# EAGLE design Fubarino_SD_v14t (EAGLE 6.3)
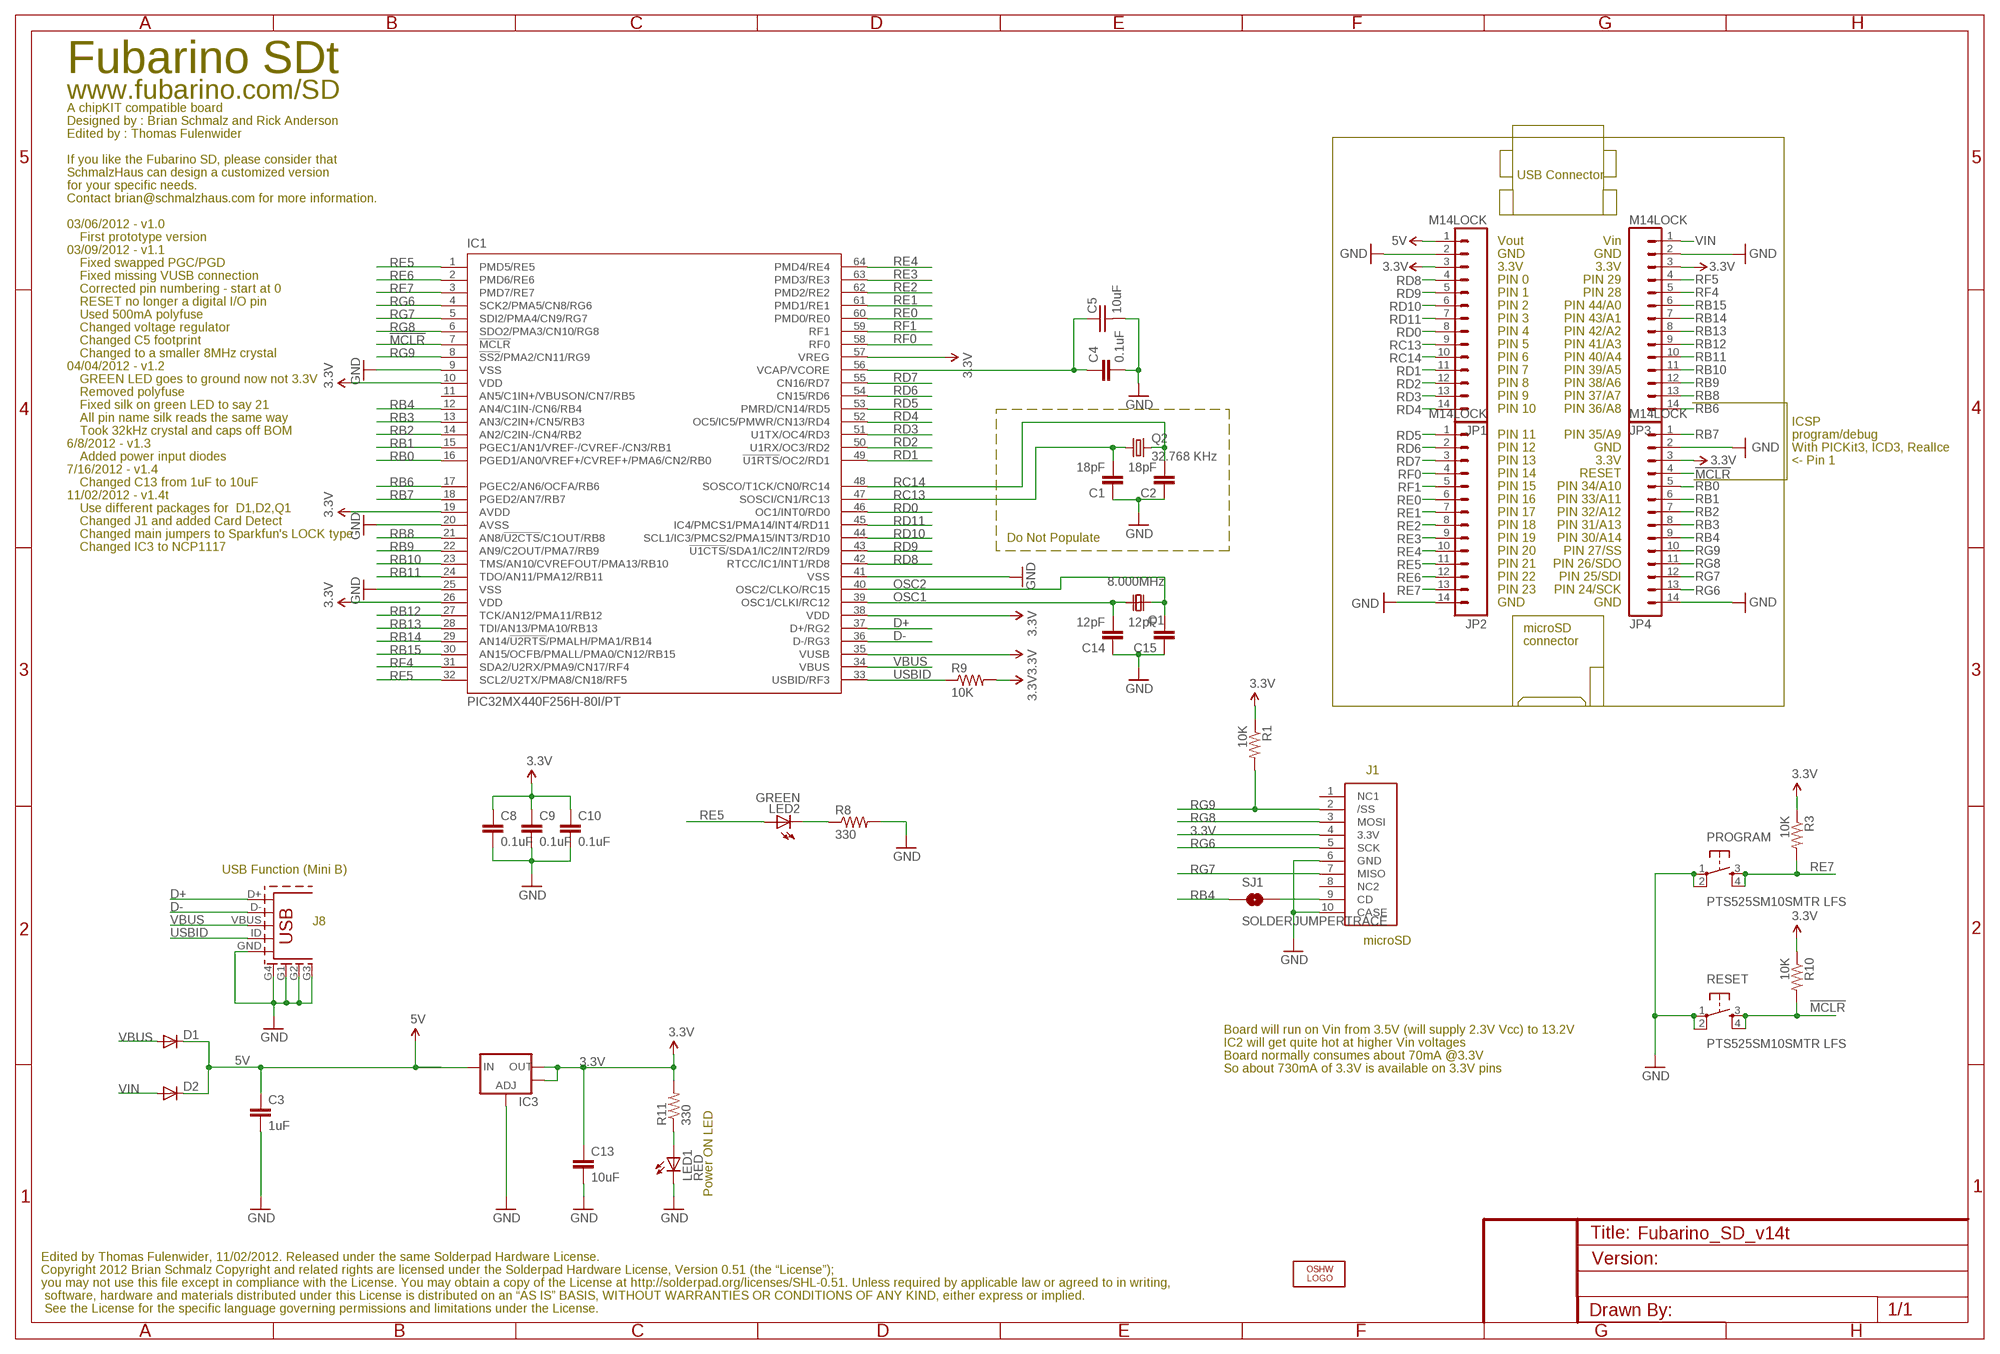
[diagram p0: schematic, sheet 1]

## Parts
C1  18pF  CAP0603-CAP  [0603-CAP]
C2  18pF  CAP0603-CAP  [0603-CAP]
C3  1uF  CAP0603-CAP  [0603-CAP]
C4  0.1uF  CAP0603-CAP  [0603-CAP]
C5  10uF  CAP0805  [CAP_0805]
C8  0.1uF  CAP0603-CAP  [0603-CAP]
C9  0.1uF  CAP0603-CAP  [0603-CAP]
C10  0.1uF  CAP0603  [0603]
C13  10uF  CAP0805  [0805]
C14  12pF  CAP0603-CAP  [0603-CAP]
C15  12pF  CAP0603-CAP  [0603-CAP]
D1  DIODE-SOD123  [SOD123]
D2  DIODE-SOD123  [SOD123]
IC1  PIC32MX440F256H-80I/PT  PIC32MX440F256H  [TQFP64-10X10]
IC3  V_REG_LM1117SOT223  [SOT223]
J8  UX60A-MB-5ST  USB_5PIN  [USB-MINIB]
JP1  M14LOCK  [1X14_LOCK]
JP2  M14LOCK  [1X14_LOCK]
JP3  M14LOCK  [1X14_LOCK]
JP4  M14LOCK  [1X14_LOCK]
LED1  RED  LED0603  [LED-0603]
LED2  GREEN  LED0603  [LED-0603]
LOGO1  OSHW_LOGO_8MILX0070-NT  [OSHW_8X70_NOTEXT]
PROGRAM  PTS525SM10SMTR LFS  TAC_SWITCHSMD  [TACTILE_SWITCH_SMD]
Q1  8.000MHz  METRIC_XTAL6035_METRIC  [6035_METRIC]
Q2  32.768 KHz  CRYSTALTC26H  [TC26H]
R1  10K  RESISTOR0603-RES  [0603-RES]
R3  10K  RESISTOR0603-RES  [0603-RES]
R8  330  RESISTOR0603-RES  [0603-RES]
R9  10K  RESISTOR0603-RES  [0603-RES]
R10  10K  RESISTOR0603-RES  [0603-RES]
R11  330  RESISTOR0603-RES  [0603-RES]
RESET  PTS525SM10SMTR LFS  TAC_SWITCHSMD  [TACTILE_SWITCH_SMD]
SJ1  SOLDERJUMPERTRACE  [SJ_2S-TRACE]
U$2  SDCARDMICROSD1  [MICROSD]

## Nets
3.3V: C8.1 C9.1 C10.1 C13.1 IC1.10(VDD) IC1.19(AVDD) IC1.26(VDD) IC1.35(VUSB) IC1.38(VDD) IC1.57(VREG) IC3.2(OUT) IC3.4(OUT) JP1.3 JP3.3 JP4.3 R1.1 R3.1 R9.2 R10.1 R11.2 U$2.4(3.3V)
5V: C3.1 D1.C D2.C IC3.3(IN) JP1.1
!MCLR!: IC1.7(!MCLR) JP4.4 R10.2 RESET.3 RESET.4
D+: IC1.37(D+/RG2) J8.D+
D-: IC1.36(D-/RG3) J8.D-
GND: C1.1 C2.1 C3.2 C4.2 C5.2 C8.2 C9.2 C10.2 C13.2 C14.1 C15.1 IC1.9(VSS) IC1.20(AVSS) IC1.25(VSS) IC1.41(VSS) IC3.1(ADJ) J8.G1 J8.G2 J8.G3 J8.G4(SHIELD) J8.GND JP1.2 JP2.14 JP3.2 JP4.2 JP4.14 LED1.C PROGRAM.1 PROGRAM.2 R8.2 RESET.1 RESET.2 U$2.6(GND) U$2.10(CASE)
N$1: SJ1.2 U$2.9(CD)
N$6: LED1.A R11.1
N$20: LED2.C R8.1
N$110: C4.1 C5.1 IC1.56(VCAP/VCORE)
OSC1: C14.2 IC1.39(OSC1/CLKI/RC12) Q1.P$1
OSC2: C15.2 IC1.40(OSC2/CLKO/RC15) Q1.P$2
RB0: IC1.16(PGED1/AN0/VREF+/CVREF+/PMA6/CN2/RB0) JP4.5
RB1: IC1.15(PGEC1/AN1/VREF-/CVREF-/CN3/RB1) JP4.6
RB2: IC1.14(AN2/C2IN-/CN4/RB2) JP4.7
RB3: IC1.13(AN3/C2IN+/CN5/RB3) JP4.8
RB4: IC1.12(AN4/C1IN-/CN6/RB4) JP4.9 SJ1.1
RB6: IC1.17(PGEC2/AN6/OCFA/RB6) JP3.14
RB7: IC1.18(PGED2/AN7/RB7) JP4.1
RB8: IC1.21(AN8/!U2CTS!/C1OUT/RB8) JP3.13
RB9: IC1.22(AN9/C2OUT/PMA7/RB9) JP3.12
RB10: IC1.23(TMS/AN10/CVREFOUT/PMA13/RB10) JP3.11
RB11: IC1.24(TDO/AN11/PMA12/RB11) JP3.10
RB12: IC1.27(TCK/AN12/PMA11/RB12) JP3.9
RB13: IC1.28(TDI/AN13/PMA10/RB13) JP3.8
RB14: IC1.29(AN14/!U2RTS!/PMALH/PMA1/RB14) JP3.7
RB15: IC1.30(AN15/OCFB/PMALL/PMA0/CN12/RB15) JP3.6
RC13: C1.2 IC1.47(SOSCI/CN1/RC13) JP1.9 Q2.1
RC14: C2.2 IC1.48(SOSCO/T1CK/CN0/RC14) JP1.10 Q2.2
RD0: IC1.46(OC1/INT0/RD0) JP1.8
RD1: IC1.49(!U1RTS!/OC2/RD1) JP1.11
RD2: IC1.50(U1RX/OC3/RD2) JP1.12
RD3: IC1.51(U1TX/OC4/RD3) JP1.13
RD4: IC1.52(OC5/IC5/PMWR/CN13/RD4) JP1.14
RD5: IC1.53(PMRD/CN14/RD5) JP2.1
RD6: IC1.54(CN15/RD6) JP2.2
RD7: IC1.55(CN16/RD7) JP2.3
RD8: IC1.42(RTCC/IC1/INT1/RD8) JP1.4
RD9: IC1.43(!U1CTS!/SDA1/IC2/INT2/RD9) JP1.5
RD10: IC1.44(SCL1/IC3/PMCS2/PMA15/INT3/RD10) JP1.6
RD11: IC1.45(IC4/PMCS1/PMA14/INT4/RD11) JP1.7
RE0: IC1.60(PMD0/RE0) JP2.6
RE1: IC1.61(PMD1/RE1) JP2.7
RE2: IC1.62(PMD2/RE2) JP2.8
RE3: IC1.63(PMD3/RE3) JP2.9
RE4: IC1.64(PMD4/RE4) JP2.10
RE5: IC1.1(PMD5/RE5) JP2.11 LED2.A
RE6: IC1.2(PMD6/RE6) JP2.12
RE7: IC1.3(PMD7/RE7) JP2.13 PROGRAM.3 PROGRAM.4 R3.2
RF0: IC1.58(RF0) JP2.4
RF1: IC1.59(RF1) JP2.5
RF4: IC1.31(SDA2/U2RX/PMA9/CN17/RF4) JP3.5
RF5: IC1.32(SCL2/U2TX/PMA8/CN18/RF5) JP3.4
RG6: IC1.4(SCK2/PMA5/CN8/RG6) JP4.13 U$2.5(SCK)
RG7: IC1.5(SDI2/PMA4/CN9/RG7) JP4.12 U$2.7(MISO)
RG8: IC1.6(SDO2/PMA3/CN10/RG8) JP4.11 U$2.3(MOSI)
RG9: IC1.8(!SS2!/PMA2/CN11/RG9) JP4.10 R1.2 U$2.2(/SS)
USBID: IC1.33(USBID/RF3) J8.ID(USB_ID) R9.1
VBUS: D1.A IC1.34(VBUS) J8.VBUS
VIN: D2.A JP3.1
Unconnected: IC1.11(AN5/C1IN+/VBUSON/CN7/RB5) U$2.1(NC1) U$2.8(NC2)

## Notes on the sheet
- Fubarino SDt
- www.fubarino.com/SD
- A chipKIT compatible board
- Designed by : Brian Schmalz and Rick Anderson
- Edited by : Thomas Fulenwider
- If you like the Fubarino SD, please consider that
- SchmalzHaus can design a customized version | USB Connector
- for your specific needs.
- Contact brian@schmalzhaus.com for more information.
- 03/06/2012 - v1.0
- Vin
- First prototype version
- Vout
- GND
- 03/09/2012 - v1.1
- GND
- 3.3V
- Fixed swapped PGC/PGD
- 3.3V
- PIN 29
- Fixed missing VUSB connection
- PIN 0
- PIN 28
- Corrected pin numbering - start at 0
- PIN 1
- PIN 44/A0
- RESET no longer a digital I/O pin
- PIN 2
- PIN 43/A1
- Used 500mA polyfuse
- PIN 3
- PIN 42/A2
- Changed voltage regulator
- PIN 4
- PIN 41/A3
- Changed C5 footprint
- PIN 5
- PIN 40/A4
- Changed to a smaller 8MHz crystal
- PIN 6
- PIN 39/A5
- 04/04/2012 - v1.2
- PIN 7
- PIN 38/A6
- GREEN LED goes to ground now not 3.3V
- PIN 8
- PIN 37/A7
- Removed polyfuse
- PIN 9
- PIN 36/A8
- Fixed silk on green LED to say 21
- PIN 10
- All pin name silk reads the same way
- ICSP
- PIN 35/A9
- Took 32kHz crystal and caps off BOM
- PIN 11 | program/debug
- GND
- 6/8/2012 - v1.3
- PIN 12 | With PICKit3, ICD3, RealIce
- 3.3V
- Added power input diodes
- PIN 13 | <- Pin 1
- RESET
- 7/16/2012 - v1.4
- PIN 14
- PIN 34/A10
- Changed C13 from 1uF to 10uF
- PIN 15
- PIN 33/A11
- 11/02/2012 - v1.4t
- PIN 16
- PIN 32/A12
- Use different packages for  D1,D2,Q1
- PIN 17
- PIN 31/A13
- Changed J1 and added Card Detect
- PIN 18
- PIN 30/A14
- Changed main jumpers to Sparkfun's LOCK type
- Do Not Populate | PIN 19
- PIN 27/SS
- Changed IC3 to NCP1117
- PIN 20
- PIN 26/SDO
- PIN 21
- PIN 25/SDI
- PIN 22
- PIN 24/SCK
- PIN 23
- GND
- GND
- microSD
- connector
- J1
- USB Function (Mini B)
- J8
- microSD
- Board will run on Vin from 3.5V (will supply 2.3V Vcc) to 13.2V
- IC2 will get quite hot at higher Vin voltages
- Board normally consumes about 70mA @3.3V
- So about 730mA of 3.3V is available on 3.3V pins
- Power ON LED
- Edited by Thomas Fulenwider, 11/02/2012. Released under the same Solderpad Hardware License.
- Copyright 2012 Brian Schmalz Copyright and related rights are licensed under the Solderpad Hardware License, Version 0.51 (the “License”);
- you may not use this file except in compliance with the License. You may obtain a copy of the License at http://solderpad.org/licenses/SHL-0.51. Unless required by applicable law or agreed to in writing,
- software, hardware and materials distributed under this License is distributed on an “AS IS” BASIS, WITHOUT WARRANTIES OR CONDITIONS OF ANY KIND, either express or implied.
- See the License for the specific language governing permissions and limitations under the License.

## Library data of the parts
C1-C4 C8 C9 C14 C15 = SparkFun:CAP: Capacitor Standard 0603 ceramic capacitor, and 0.1" leaded capacitor.
C5 = SchmalzHaus:CAP
C10 C13 = SparkFun02-20-08:CAP: Capacitor Standard 0603 ceramic capacitor, and 0.1" leaded capacitor.
D1 D2 = diode:DIODE-: DIODE
IC1 = SchmalzHaus:PIC32MX440F256H: PIC32MX440F256H edit this description Auto generated by make-symbol-device-package-bsdl.ulp Rev. 25 Source: PIC32MX440F256H.bsdl
IC3 = SparkFun:V_REG_LM1117: Voltage Regulator LM1117 Standard adjustable voltage regulator but in SMD form. Spark Fun Electronics SKU : COM-00595
J8 = SparkFun02-20-08:USB_5PIN
JP1-JP4 = TEF_made3:M14: Header 14 Standard 14-pin 0.1" header. Use with straight break away headers (SKU : PRT-00116), right angle break away headers (PRT-00553), swiss pins (PRT-00743), machine pins (PRT-00117), and female headers (PRT-00115).
LED1 LED2 = SparkFun:LED: LEDs Standard schematic elements and footprints for 5mm, 3mm, 1206, and 0603 sized LEDs. 5mm - Spark Fun Electronics SKU : COM-00529 (and others)
LOGO1 = OSHW:OSHW_LOGO_8MIL
PROGRAM RESET = TEF_made3:TAC_SWITCH: Momentary Switch Button commonly used for reset or general input. Spark Fun Electronics SKU : COM-00097
Q1 = TEF_made3:METRIC_XTAL
Q2 = SchmalzHaus:CRYSTAL: Crystals Various standard crystals. Proven footprints. Spark Fun Electronics SKU : COM-00534
R1 R3 R8-R11 = SparkFun:RESISTOR: Resistor Basic schematic elements and footprints for 0603, 1206, and PTH resistors.
SJ1 = SparkFun:SOLDERJUMPER: Solder Jumper Standard SMD solder jumper. Used to automate production. Two varients : Normally Open and Normally Closed are the same, but have different paste layers. NC will have a large amount of paste and should jumper during reflow.
U$2 = TEF_made3:SDCARD

## Board
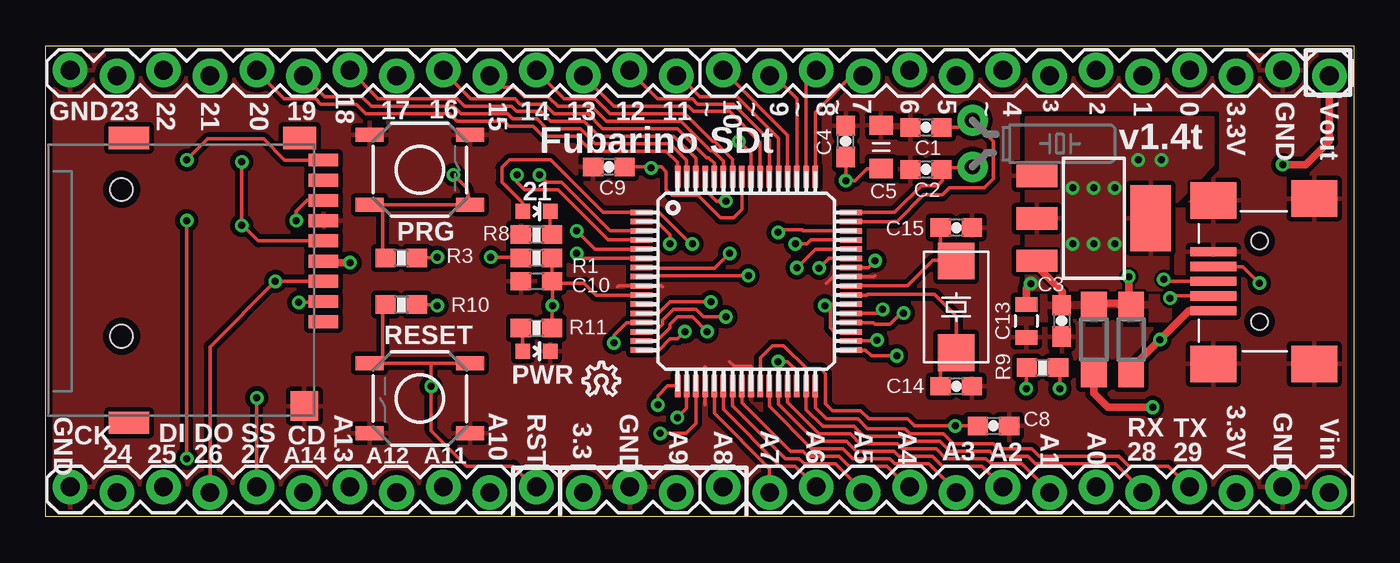
[diagram p1: board, top side]
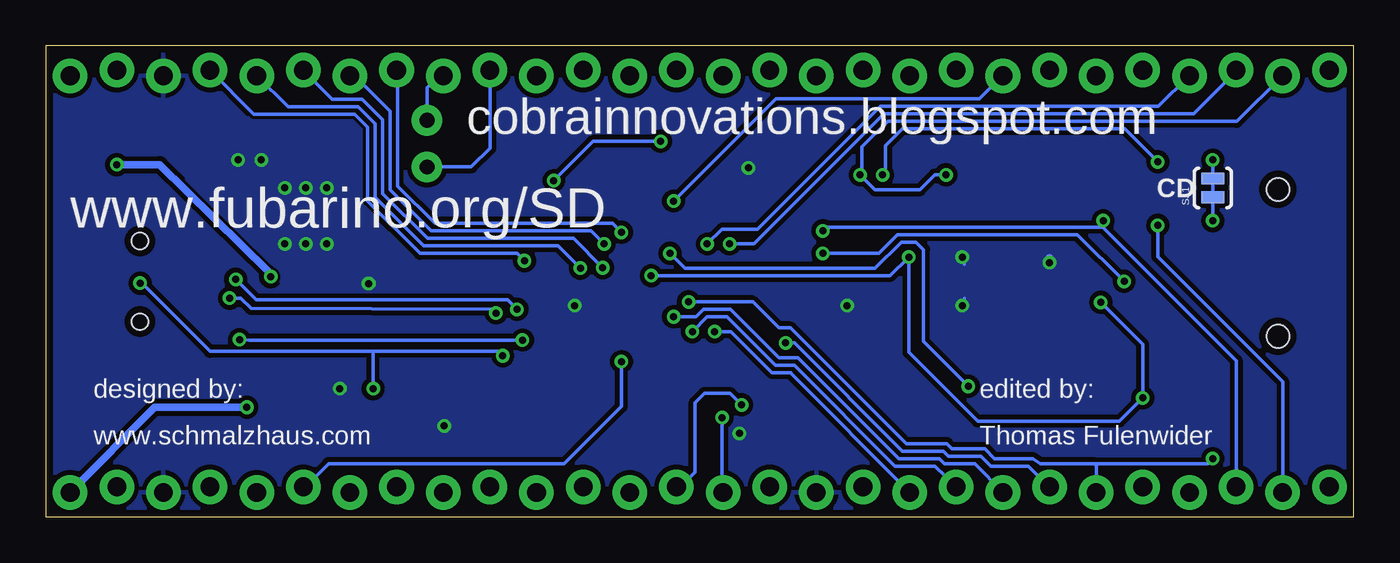
[diagram p2: board, bottom side, seen from below]

Size 71.22 x 25.63 mm. Coordinates in mm from the lower left corner, seen from the top.
Outline: 0,25.63 71.22,25.63 71.22,0 0,0 0,25.63
Copper layers (1*16): Top 0.0356mm / dielectric 1.5011mm / Bottom 0.0356mm
Design rules "default": minimum track width 6mil, minimum drill 13mil, track to track 6mil, track to pad 6mil, pad to pad 6mil, via to via 6mil, smd to smd 6mil, copper to edge 15mil, drill to drill 6mil, minimum pad ring 7mil, minimum via ring 7mil, stop-mask expansion 4mil, vias tented up to drill 16mil, thermal gap 10mil

### Footprints (pad centres in the part's own frame; a part is rotated, then mirrored left to right if it is on the bottom)
0603-CAP = smd 1.1 x 1: 1 -0.85,0; 2 0.85,0
CAP_0805 = smd 1.05 x 1.3: 1 -1.175,0; 2 1.175,0
0603 = smd 1.1 x 1: 1 -0.85,0; 2 0.85,0
0805 = smd 0.8 x 1.2: 1 -0.9,0; 2 0.9,0
SOD123 = smd 1.4 x 1.4: A 1.9,0; C -1.9,0
TQFP64-10X10 = smd 1.2 x 0.3: 1 -5.7,3.75; 2 -5.7,3.25; 3 -5.7,2.75; 4 -5.7,2.25; 5 -5.7,1.75; 6 -5.7,1.25; 7 -5.7,0.75; 8 -5.7,0.25; 9 -5.7,-0.25; 10 -5.7,-0.75; 11 -5.7,-1.25; 12 -5.7,-1.75; 13 -5.7,-2.25; 14 -5.7,-2.75; 15 -5.7,-3.25; 16 -5.7,-3.75; 33 5.7,-3.75; 34 5.7,-3.25; 35 5.7,-2.75; 36 5.7,-2.25; 37 5.7,-1.75; 38 5.7,-1.25; 39 5.7,-0.75; 40 5.7,-0.25; 41 5.7,0.25; 42 5.7,0.75; 43 5.7,1.25; 44 5.7,1.75; 45 5.7,2.25; 46 5.7,2.75; 47 5.7,3.25; 48 5.7,3.75 | smd 0.3 x 1.2: 17 -3.75,-5.7; 18 -3.25,-5.7; 19 -2.75,-5.7; 20 -2.25,-5.7; 21 -1.75,-5.7; 22 -1.25,-5.7; 23 -0.75,-5.7; 24 -0.25,-5.7; 25 0.25,-5.7; 26 0.75,-5.7; 27 1.25,-5.7; 28 1.75,-5.7; 29 2.25,-5.7; 30 2.75,-5.7; 31 3.25,-5.7; 32 3.75,-5.7; 49 3.75,5.7; 50 3.25,5.7; 51 2.75,5.7; 52 2.25,5.7; 53 1.75,5.7; 54 1.25,5.7; 55 0.75,5.7; 56 0.25,5.7; 57 -0.25,5.7; 58 -0.75,5.7; 59 -1.25,5.7; 60 -1.75,5.7; 61 -2.25,5.7; 62 -2.75,5.7; 63 -3.25,5.7; 64 -3.75,5.7
SOT223 = smd 1.219 x 2.235: 1 -2.311,-3.099; 2 0,-3.099; 3 2.311,-3.099 | smd 3.6 x 2.2: 4 0,3.099
USB-MINIB = smd 2.5 x 0.5: D+ 2.5,0; D- 2.5,0.8; GND 2.5,-1.6; ID 2.5,-0.8; VBUS 2.5,1.6 | smd 2.5 x 2: G1 -3,4.5; G2 2.5,4.5; G3 -3,-4.5; G4 2.5,-4.4 | hole 0.9: 0,2.2; 0,-2.2
1X14_LOCK = drill 1.016 pad 1.88: 1 0,0.152; 2 2.54,-0.152; 3 5.08,0.152; 4 7.62,-0.152; 5 10.16,0.152; 6 12.7,-0.152; 7 15.24,0.152; 8 17.78,-0.152; 9 20.32,0.152; 10 22.86,-0.152; 11 25.4,0.152; 12 27.94,-0.152; 13 30.48,0.152; 14 33.02,-0.152
LED-0603 = smd 0.8 x 0.8: A 0,-0.75; C 0,0.75
TACTILE_SWITCH_SMD = smd 1.524 x 0.762: 1 -2.74,1.905; 2 2.74,1.905; 3 -2.74,-1.905; 4 2.74,-1.905
6035_METRIC = smd 2 x 2: P$1 -2.5,0; P$2 2.5,0
TC26H = drill 0.813 pad 1.676: 1 -1.27,0; 2 1.27,0
0603-RES = smd 1.1 x 1: 1 -0.85,0; 2 0.85,0
SJ_2S-TRACE = smd 0.635 x 1.27: 1 -0.508,0; 2 0.508,0
MICROSD = smd 0.7 x 1.6: 1 -2.2,-7.7; 2 -1.1,-7.7; 3 0,-7.7; 4 1.1,-7.7; 5 2.2,-7.7; 6 3.3,-7.7; 7 4.4,-7.7; 8 5.5,-7.7; 9 6.6,-7.7 | smd 1.6 x 1.5: 10 -6.8,-6.65 | smd 1.2 x 1.8: 11 7.8,-6.4 | smd 1.2 x 2.2: 12 -7.7,2.9; 13 7.8,2.9 | hole 1.25: -3,3.3; 5,3.3

### Placement (x,y rotation side)
C1  47.93,21.2 0 top
C2  47.93,18.91 0 top
C3  55.32,10.66 270 top
C4  43.56,20.43 90 top
C5  45.49,20.13 90 top
C8  51.61,4.94 0 top
C9  30.66,19.04 180 top
C10  26.72,12.81 180 top
C13  53.39,10.66 270 top
C14  49.58,7.1 180 top
C15  49.58,15.74 180 top
D1  59.11,9.64 270 top
D2  57.07,9.64 270 top
IC1  38.15,12.81 0 top
IC3  57.07,16.24 270 top
J8  66.09,12.81 180 top
JP1  69.9,24.16 180 top
JP2  34.34,24.16 180 top
JP3  69.9,1.47 180 top
JP4  34.34,1.47 180 top
LED1  26.72,9 270 top
LED2  26.72,16.62 270 top
LOGO1  29.26,6.62 0 top
PROGRAM  20.37,18.88 0 top
Q1  49.58,11.42 90 top
Q2  50.47,20.31 270 top
R1  26.72,14.08 180 top
R3  19.35,14.08 180 top
R8  26.72,15.35 180 top
R9  54.28,8.12 0 top
R10  19.35,11.54 180 top
R11  26.72,10.27 0 top
RESET  20.37,6.44 180 top
SJ1  7.67,17.89 90 bottom
U$2  7.42,12.81 90 top

### Tracks (layer width: path | path; a pad name or v marks a point on that pad's centre or on a via)
3.3V  (via drill 0.38)
  Top 0.203: IC1.57 37.9,16.73 37.44,16.27 36.73,16.27 35.51,17.49 34.09,17.49 33.78,17.79 33.78,18.78 33.53,19.04 33.05,19.04 | IC1.10 29.96,12.06 29.31,12.71 27.67,12.71 | 27.67,12.71 27.67,12.7 | R3.1 21.13,14.08 v21.31,14.14 | R10.1 21.13,11.54 v21.31,11.49 | 42.72,11.56 42.49,11.56 v42.42,11.49 | 42.72,11.56 IC1.38 | IC1.35 42.93,10.06 42.72,10.27 42.72,11.56 | IC1.26 38.91,7.11 38.91,8.65 39.57,9.31 40.18,9.31 41.45,8.04 42.21,8.04 42.47,7.79 42.47,6.16 42.85,5.78 44.37,5.78 44.83,5.32 46.91,5.32 47.29,4.94 v49.53,4.94 C8.1 | IC1.19 35.4,5.09 34.85,4.53 v33.45,4.53 | C10.1 R1.1 | C10.1 27.67,12.71 | C10.1 27.58,12.8 v27.58,11.49 27.57,11.48 R11.2 | 31.43,19.22 C9.1 33.05,19.04 | 33.05,19.04 v32.97,18.99 | v55.22,6.97 55.22,7.95 R9.2
  Top 0.406: v53.64,12.69 53.39,12.43 C13.1 53.39,11.93 | U$2.4 15.2,13.83 v16.56,13.83
  Bottom 0.203: v21.31,14.14 21.18,13.73 | v21.31,11.49 21.18,11.9
  Bottom 0.406: v16.56,13.83 16.56,14.08
  other vias: 57.07,17.89 55.93,14.85 57.07,14.85 58.22,14.85 55.93,17.89 58.22,17.89 59.49,19.42 60.76,19.42
  pour Bottom (isolate 0.254, rank 3): 0.05,0.11 0.05,25.51 71.17,25.51 71.17,0.11
  pour Bottom: 53.39,21.7 53.39,12.81 63.55,12.81 63.55,21.7
  pour Top: 63.55,21.7 53.39,21.7 53.39,12.36 61.11,12.36 61.11,16.62 63.55,19.16
5V  (via drill 0.38)
  Top 0.406: v67.36,19.16 68.63,19.16 69.9,20.43 JP1.1 | v58.98,13.07 58.98,12.01 58.81,11.63 | 58.81,11.63 57.43,11.63 | C3.1 55.37,11.93 55.37,12.24 54.15,13.45 54.15,14.26 IC3.3 | 58.81,11.63 58.47,11.54 58.48,11.54 D1.C
  Bottom 0.406: v67.36,19.16 65.02,19.16 59.11,13.37 v58.98,13.07
  pour Top (rank 2): 54.28,10.78 61.14,10.78 61.14,12.18 54.28,12.18
!MCLR!  (via drill 0.38)
  Top 0.203: v37.24,14.34 36.42,13.53 33.27,13.53 33.23,13.56 IC1.7 | RESET.4 18.34,8.34 | 18.34,8.34 20.98,8.34 | 20.98,8.34 RESET.3 | 20.98,8.34 v20.98,7.1 20.98,4.69 22.91,2.76 25.45,2.76 26.72,1.49 JP4.4 | R10.2 18.34,11.54 18.34,8.34
  Bottom 0.203: v37.24,14.34 36.42,13.53 26.06,13.53 24.64,14.95 23.82,14.95 23.42,14.54 23.42,9.54 v20.98,7.1
D+  (via drill 0.38)
  Top 0.203: J8.D+ 60.88,12.81 v60.88,12.92 | IC1.37 45.34,11.06 v45.57,11.29
  Bottom 0.203: v60.88,12.92 59.77,11.8 46.08,11.8 v45.57,11.29
D-  (via drill 0.38)
  Top 0.203: J8.D- 61.33,12.01 v61.21,11.9 | IC1.36 45.07,10.56 45.16,10.48 45.97,10.48 46.71,11.21 v46.71,11.09
  Bottom 0.203: v61.21,11.9 60.6,11.9 60.05,11.34 46.91,11.29 v46.71,11.09
GND
  Top 0.203: 45.16,13.12 45.11,13.06 IC1.41 42.87,13.06 42.52,12.71 | IC1.25 38.4,8.19 37.49,8.19 37.24,8.45 | 35.9,6.09 IC1.20 35.9,8.16 | 33.58,12.51 33.52,12.56 IC1.9 31.19,12.56 31.14,12.51
  pour Top (isolate 0.254, rank 4): 0.05,25.51 0.05,0.11 71.17,0.11 71.17,25.51
N$1  (via drill 0.38)
  Top 0.203: U$2.9 13.01,19.41 11.86,20.56 8.81,20.56 v7.67,19.42
  Bottom 0.203: SJ1.2 v7.67,19.42
N$6
  Top 0.203: 25.87,10.17 R11.1 25.97,10.17 LED1.A
N$20
  Top 0.203: LED2.C 27.47,15.45 R8.1
N$110  (via drill 0.38)
  Top 0.203: IC1.56 38.4,19.78 v37.74,20.43 | C4.1 v43.56,18.3 44.07,18.3 44.72,18.95 C5.1
  Bottom 0.203: v37.74,20.43 41.43,20.43 v43.56,18.3
OSC1
  Top 0.203: IC1.39 44.72,12.06 44.75,12.1 48.39,12.1 49.58,10.91 49.58,9 | C14.2 48.73,8.15 49.58,9 | 49.58,9 Q1.P$1
OSC2
  Top 0.203: IC1.40 46.92,12.56 48.31,13.96 49.45,13.96 | 49.45,13.96 49.49,13.96 | C15.2 48.73,13.66 49.45,13.96
  Top 0.406: 49.49,13.96 49.49,13.99 49.58,14.08 Q1.P$2
RB0  (via drill 0.38)
  Top 0.203: v34.8,10.07 34.4,9.67 33.99,9.67 33.38,9.06 IC1.16
  Bottom 0.203: v34.8,10.07 33.91,10.07 31.67,7.84 30.63,7.84 30.63,7.8 JP4.5
RB1  (via drill 0.38)
  Top 0.203: IC1.15 33.27,9.56 33.98,10.27 33.98,10.48 34.39,10.88 35.2,10.88 v36.02,10.07
  Bottom 0.203: v36.02,10.07 35.2,10.88 34.14,10.88 31.5,8.24 30.45,8.24 24.97,2.76 22.8,2.76 JP4.6
RB2  (via drill 0.38)
  Top 0.203: IC1.14 33.17,10.06 33.58,10.48 33.58,10.68 34.19,11.29 35.41,11.29 35.81,10.88 v37.03,10.88
  Bottom 0.203: v37.03,10.88 35.81,10.88 35.41,11.29 33.93,11.29 31.29,8.65 30.25,8.65 24.76,3.16 22.55,3.16 22.28,2.88 20.64,2.88 JP4.7
RB3  (via drill 0.38)
  Top 0.203: IC1.13 31.63,10.56 30.94,9.87 v30.94,9.46
  Bottom 0.203: v30.94,9.46 30.45,9.46 24.56,3.57 22.35,3.57 22.07,3.29 20.29,3.29 19.76,2.76 17.72,2.76 JP4.8
RB4  (via drill 0.38)
  Top 0.203: IC1.12 33.35,11.06 33.98,11.7 v36.22,11.7 | v7.67,3.16 v7.67,16.12
  Bottom 0.203: v36.22,11.7 32.71,11.7 31.29,10.27 30.66,10.27 24.36,3.98 22.15,3.98 21.87,3.7 20.09,3.7 19.56,3.16 17.47,3.16 17.07,2.88 14.12,2.88 | 14.12,2.88 14.02,2.78 JP4.9 | 14.12,2.88 7.95,2.88 v7.67,3.16 | SJ1.1 v7.67,16.12
RB6  (via drill 0.38)
  Top 0.203: IC1.17 33.85,7.11 33.32,6.59 v33.32,6.08
  Bottom 0.203: v33.32,6.08 33.96,6.72 35.36,6.72 35.86,6.21 35.86,2.43 36.88,1.41 JP3.14
RB7  (via drill 0.38)
  Top 0.203: IC1.18 34.9,5.91 v34.39,5.4
  Bottom 0.203: v34.39,5.4 34.39,1.4 JP4.1
RB8
  Top 0.203: IC1.21 36.4,5.62 39.42,2.6 JP3.13
RB9
  Top 0.203: IC1.22 36.9,5.83 39.98,2.76 40.8,2.76 JP3.12
RB10
  Top 0.203: IC1.23 37.4,6.05 40.28,3.16 41.02,3.16 41.3,2.88 43,2.88 44.5,1.38 JP3.11
RB11
  Top 0.203: IC1.24 37.9,6.21 40.54,3.57 41.22,3.57 41.5,3.29 43.21,3.29 43.74,2.76 45.8,2.76 47.04,1.51 JP3.10
RB12
  Top 0.203: IC1.27 39.4,6 41.71,3.7 43.41,3.7 43.94,3.16 45.97,3.16 46.25,2.88 48.08,2.88 49.58,1.38 JP3.9
RB13
  Top 0.203: IC1.28 39.9,6.11 41.91,4.1 43.61,4.1 44.14,3.57 46.18,3.57 46.46,3.29 48.29,3.29 48.82,2.76 50.96,2.76 JP3.8
RB14
  Top 0.203: IC1.29 40.4,6.22 42.11,4.51 43.81,4.51 44.35,3.98 46.38,3.98 46.66,3.7 48.49,3.7 49.02,3.16 51.21,3.16 51.49,2.88 53.16,2.88 54.66,1.38 JP3.7
RB15  (via drill 0.38)
  Top 0.203: v39.88,8.45 40.39,8.45 40.9,7.93 IC1.30
  Bottom 0.203: v39.88,8.45 39.88,6.01 43,2.88 55.83,2.88 57.2,1.51 JP3.6
RC13
  Top 0.203: IC1.47 46.35,16.06 47.8,17.51 48.82,17.51 49.2,17.89 51.1,17.89 51.61,18.4 51.61,20.43 Q2.1 50.09,21.2 C1.2
  Bottom 0.203: Q2.1 50.47,23.36 49.58,24.24 JP1.9
RC14
  Top 0.203: IC1.48 46.22,16.56 47.68,18.02 48.56,18.02 48.82,18.28 48.82,19 | 48.82,19 C2.2 | 48.82,19 50.43,19 Q2.2
  Bottom 0.203: Q2.2 48.06,19.04 47.04,20.05 JP1.10
RD0  (via drill 0.38)
  Top 0.203: IC1.46 41.24,15.56 41.2,15.61 40,15.61 v39.88,15.48
  Bottom 0.203: v39.88,15.48 40.36,15.96 50.04,15.96 52.07,18 52.07,24.23 JP1.8
RD1
  Top 0.203: IC1.49 41.9,22.03 44.12,24.24 44.28,24.24 JP1.11
RD2
  Top 0.203: IC1.50 41.4,23.72 JP1.12
RD3
  Top 0.203: IC1.51 40.9,22.76 39.42,24.24 JP1.13
RD4
  Top 0.203: IC1.52 40.4,20.78 36.98,24.19 36.93,24.19 36.93,24.23 JP1.14
RD5
  Top 0.203: IC1.53 39.9,20.61 37.64,22.87 35.64,22.87 34.59,23.91 34.42,23.91 34.34,23.99 JP2.1
RD6
  Top 0.203: IC1.54 39.4,20.51 37.44,22.47 35.48,22.47 35.2,22.75 33.3,22.75 31.8,24.24 JP2.2
RD7
  Top 0.203: IC1.55 38.9,20.4 37.24,22.06 35.28,22.06 35,22.34 30.95,22.34 JP2.3
RD8  (via drill 0.38)
  Top 0.203: IC1.42 44.79,13.56 v45.16,13.93
  Bottom 0.203: v45.16,13.93 45.57,14.34 50.85,14.34 53.7,17.18 53.7,21.2 54.41,21.91 59.91,21.91 JP1.4
RD9  (via drill 0.38)
  Top 0.203: IC1.43 42.65,14.06 v42.11,13.53
  Bottom 0.203: v42.11,13.53 43.33,14.74 50.65,14.74 53.29,17.39 53.29,21.4 54.2,22.31 58.03,22.31 JP1.5
RD10  (via drill 0.38)
  Top 0.203: IC1.44 41.91,14.56 v40.89,13.55
  Bottom 0.203: v40.89,13.55 42.49,15.15 50.44,15.15 52.88,17.59 52.88,21.6 54,22.72 55.64,22.72 JP1.6
RD11  (via drill 0.38)
  Top 0.203: IC1.45 41.67,15.06 41.45,14.85 v40.82,14.85
  Bottom 0.203: v40.82,14.85 41.53,15.56 50.24,15.56 52.48,17.79 52.48,22.06 54.66,24.24 JP1.7
RE0
  Top 0.203: IC1.60 36.4,19.24 36.09,19.55 35.97,19.55 34.39,21.12 30.33,21.12 29.51,21.93 27.69,21.93 27.15,22.47 25.83,22.47 25.55,22.75 23.14,22.75 21.64,24.24 JP2.6
RE1  (via drill 0.38)
  Top 0.203: IC1.61 35.9,17.81 36.52,17.18 v37.03,17.18
  Bottom 0.203: v37.03,17.18 31.47,22.75 20.38,22.75 JP2.7
RE2
  Top 0.203: IC1.62 35.4,19.5 34.19,20.71 30.12,20.71 29.31,21.53 27.48,21.53 26.95,22.06 25.63,22.06 25.35,22.34 22.81,22.34 22.4,22.75 18.06,22.75 18.06,22.78 JP2.8
RE3
  Top 0.203: IC1.63 34.9,19.39 33.98,20.31 29.92,20.31 29.11,21.12 27.28,21.12 26.75,21.65 25.43,21.65 25.15,21.93 22.61,21.93 22.2,22.34 17.73,22.34 17.2,22.87 15.18,22.87 JP2.9
RE4
  Top 0.203: IC1.64 34.4,19.28 33.78,19.9 29.72,19.9 28.9,20.71 27.08,20.71 26.54,21.25 25.22,21.25 24.94,21.53 22.4,21.53 22,21.93 17.42,21.93 16.89,22.47 14.96,22.47 14.68,22.75 12.98,22.75 11.48,24.24 JP2.10
RE5  (via drill 0.38)
  Top 0.203: v35.2,14.85 35.1,14.85 33.38,16.56 IC1.1 30.34,16.56 27.48,19.42 25.25,19.42 24.84,19.01 24.84,18.2 25.96,17.08 25.96,16.64 LED2.A
  Bottom 0.203: v35.2,14.85 34.39,15.66 32.46,15.66 25.78,22.34 10.63,22.34 JP2.11
RE6  (via drill 0.38)
  Top 0.203: IC1.2 33.27,16.06 33.98,15.35 v33.98,14.85
  Bottom 0.203: v33.98,14.85 32.66,14.85 25.58,21.93 8.71,21.93 6.4,24.24 JP2.12
RE7  (via drill 0.38)
  Top 0.203: 18.34,16.98 PROGRAM.4 22.91,17.89 v22.2,18.61 | 18.34,16.98 PROGRAM.3 | IC1.3 30.73,15.56 28.09,18.2 27.28,18.2 v26.87,18.61 | R3.2 18.34,14.08 18.34,16.98
  Bottom 0.203: v22.2,18.61 22.81,18.61 23.62,17.79 26.06,17.79 v26.87,18.61 26.77,18.71 26.77,20.13 25.37,21.53 6.36,21.53 JP2.13
RF0
  Top 0.203: IC1.58 37.4,19.46 36.42,20.43 36.3,20.43 34.8,21.93 30.73,21.93 29.92,22.75 28.22,22.75 26.72,24.24 JP2.4
RF1
  Top 0.203: IC1.59 36.9,19.35 36.32,19.93 36.19,19.93 34.59,21.53 30.53,21.53 29.72,22.34 27.89,22.34 27.36,22.87 26.03,22.87 25.53,23.38 24.92,23.38 24.18,24.12 JP2.5
RF4
  Top 0.203: IC1.31 41.4,5.83 42.32,4.92 44.02,4.92 44.55,4.38 46.58,4.38 46.86,4.1 48.69,4.1 49.22,3.57 51.41,3.57 51.69,3.29 53.49,3.29 53.9,2.88 58.24,2.88 59.74,1.38 JP3.5
RF5
  Top 0.203: IC1.32 41.9,5.94 42.52,5.32 44.22,5.32 44.75,4.79 46.79,4.79 47.07,4.51 48.89,4.51 49.43,3.98 51.61,3.98 51.89,3.7 53.7,3.7 54.1,3.29 58.45,3.29 58.98,2.76 61.12,2.76 JP3.4
RG6  (via drill 0.38)
  Top 0.203: v10.67,19.32 v10.67,15.86 10.72,15.86 11.57,15.01 U$2.5 | IC1.4 30.62,15.06 27.89,17.79 26.06,17.79 25.65,18.2 v25.65,18.61
  Bottom 0.203: v10.67,19.32 12.47,21.12 24.56,21.12 25.5,20.18 25.5,18.76 v25.65,18.61 | v10.67,15.86 10.67,14.16 3.86,7.35 JP4.13
RG7  (via drill 0.38)
  Top 0.203: IC1.5 29.9,14.56 v28.9,15.56 | v13.64,16.12 13.64,16.62 14.23,17.21 U$2.7
  Bottom 0.203: 13.66,15.76 28.7,15.76 v28.9,15.56 | 13.66,15.76 6.4,8.5 JP4.12 | 13.66,15.76 13.66,16.09 v13.64,16.12
RG8  (via drill 0.38)
  Top 0.203: IC1.6 29.18,14.06 v28.9,14.34 | U$2.3 v12.5,12.81 8.94,9.26 JP4.11
  Bottom 0.203: v28.9,14.34 25.86,14.34 24.84,15.35 15.04,15.35 v12.5,12.81
RG9  (via drill 0.38)
  Top 0.203: IC1.8 33.32,13.06 33.38,13.12 v38.25,13.12 | v24.23,14.14 25.82,14.14 R1.2 | v13.77,11.67 15.08,11.67 U$2.2 | JP4.10 v11.48,6.46
  Bottom 0.203: v38.25,13.12 25.25,13.12 v24.23,14.14 24.23,8.95 20.47,5.19 12.75,5.19 v11.48,6.46 11.48,9.39 v13.77,11.67
USBID  (via drill 0.38)
  Top 0.203: J8.ID 65.19,13.61 v66.09,12.71 | IC1.33 44.64,9.06 44.96,8.75 46.33,8.75 v46.34,8.76 | v53.39,6.97 53.39,7.99 R9.1
  Bottom 0.203: v66.09,12.71 65.99,12.71 62.28,9 53.39,9 | 53.39,9 46.58,9 v46.34,8.76 | v53.39,6.97 53.39,9
VBUS  (via drill 0.38)
  Top 0.203: IC1.34 45.21,9.56 v45.26,9.61
  Top 0.406: J8.VBUS 62.26,11.21 v60.68,9.64 58.98,7.94 D1.A
  Bottom 0.203: v60.68,9.64 60.15,9.61 v45.26,9.61
VIN  (via drill 0.38)
  Top 0.406: D2.A 57.07,6.72 57.84,5.96 v60.27,5.96
  Bottom 0.406: JP3.1 65.29,5.96 v60.27,5.96 61.14,5.96

### Text on the board
tPlace: 18 | 10 | ~ | 7 | 6 | 5 | ~ | 3 | 22 | 21 | 20 | 17 | 16 | 15 | ~ | ~ | 9 | ~ | 8 | 4 | 2 | 1 | 0 | 3.3V | GND | Vout | GND | 23 | 19 | 14 | 13 | 12 | 11 | Fubarino SDt | v1.4t | 21 | PRG | RESET | PWR | A10 | RST | 3.3V | GND | GND | A13 | 3.3 | GND | A9 | A8 | A7 | A6 | A5 | A4 | A0 | Vin | CK | DI | DO | SS | CD | A1 | RX | TX | 24 | 25 | 26 | 27 | A14 | A12 | A11 | A3 | A2 | 28 | 29
bPlace: cobrainnovations.blogspot.com | CD | www.fubarino.org/SD | edited by: | designed by: | Thomas Fulenwider | www.schmalzhaus.com
tDocu: Edited by Thomas Fulenwider, 11/02/2012. Released under the same Solderpad Hardware License. | Copyright 2012 Brian Schmalz Copyright and related rights are licensed under the Solderpad Hardware License, Version 0.51 (the “License”); | you may not use this file except in compliance with the License. You may obtain a copy of the License at http://solderpad.org/licenses/SHL-0.51. Unless required by applicable law or agreed to in writing, | software, hardware and materials distributed under this License is distributed on an “AS IS” BASIS, WITHOUT WARRANTIES OR CONDITIONS OF ANY KIND, either express or implied. | See the License for the specific language governing permissions and limitations under the License.